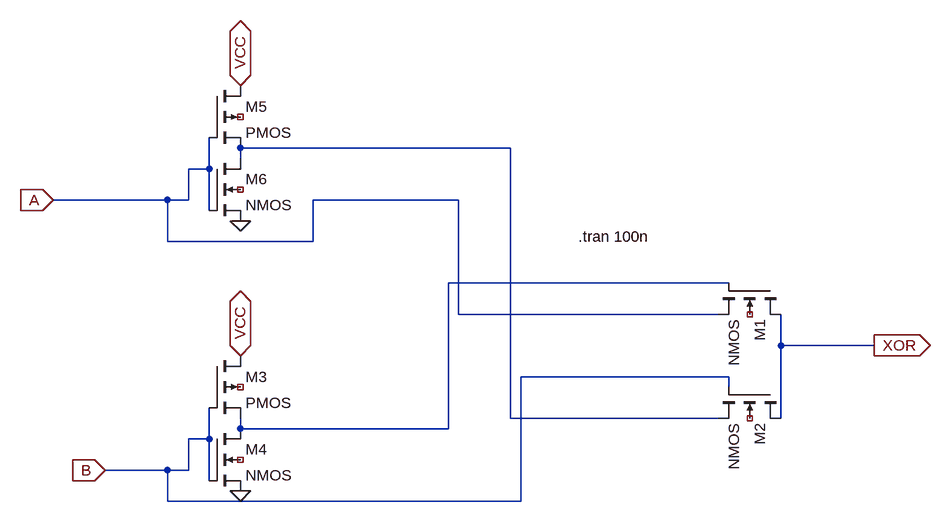
[diagram p0: schematic XORpass.asc]
XORpass.asc, the LTspice schematic file:
Version 4
SHEET 1 880 680
WIRE 144 -160 -272 -160
WIRE -272 -144 -272 -160
WIRE -320 -128 -320 -176
WIRE -320 -128 -352 -128
WIRE -384 -80 -560 -80
WIRE -352 -80 -352 -128
WIRE -352 -80 -384 -80
WIRE 64 -80 -160 -80
WIRE -320 -64 -320 -128
WIRE -384 -16 -384 -80
WIRE -160 -16 -160 -80
WIRE -160 -16 -384 -16
WIRE 480 48 48 48
WIRE 64 96 64 -80
WIRE 464 96 64 96
WIRE 560 144 560 96
WIRE 704 144 560 144
WIRE 480 192 160 192
WIRE 480 208 480 192
WIRE 144 256 144 -160
WIRE 464 256 144 256
WIRE 560 256 560 144
WIRE -272 272 -272 256
WIRE 48 272 48 48
WIRE 48 272 -272 272
WIRE -320 288 -320 240
WIRE -320 288 -352 288
WIRE -384 336 -480 336
WIRE -352 336 -352 288
WIRE -352 336 -384 336
WIRE -320 352 -320 288
WIRE -384 384 -384 336
WIRE 160 384 160 192
WIRE 160 384 -384 384
FLAG 704 144 XOR
IOPIN 704 144 Out
FLAG -560 -80 A
IOPIN -560 -80 In
FLAG -480 336 B
IOPIN -480 336 In
FLAG -272 368 0
FLAG -272 -48 0
FLAG -272 -256 VCC
IOPIN -272 -256 BiDir
FLAG -272 160 VCC
IOPIN -272 160 BiDir
SYMBOL nmos4 560 48 R90
SYMATTR InstName M1
SYMBOL nmos4 560 208 R90
SYMATTR InstName M2
SYMBOL pmos4 -320 160 R0
SYMATTR InstName M3
SYMBOL nmos4 -320 272 R0
SYMATTR InstName M4
SYMBOL pmos4 -320 -256 R0
SYMATTR InstName M5
SYMBOL nmos4 -320 -144 R0
SYMATTR InstName M6
TEXT 248 -24 Left 2 !.tran 100n

The netlist it stands for:
* XORpass.asc
M1 XOR N002 A NC_01 NMOS
M2 XOR B N001 NC_02 NMOS
M3 VCC B N002 NC_03 PMOS
M4 N002 B 0 NC_04 NMOS
M5 VCC A N001 NC_05 PMOS
M6 N001 A 0 NC_06 NMOS
.model NMOS NMOS
.model PMOS PMOS
.lib standard.mos
.tran 100n
.backanno
.end